# Altium schematic sheet LTE,GPS.SchDoc
size A; SheetNumber: 2; SheetTotal: 3
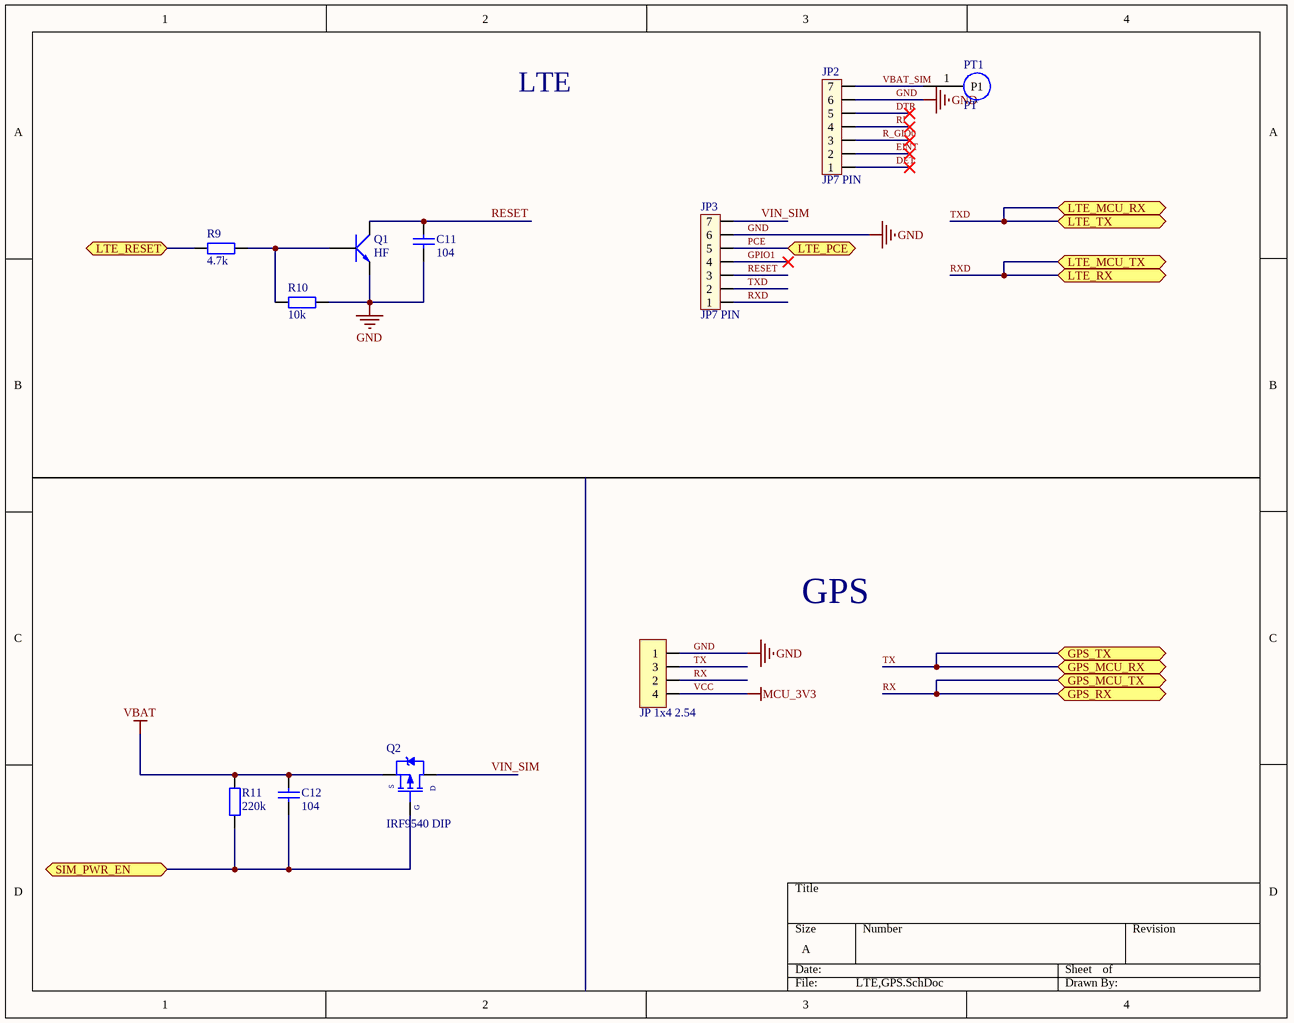
[diagram p0: LTE,GPS.SchDoc]

## Parts
C11  104  [tu 0805]
C12  104  [tu 0805]
JP2  JP7 PIN  [JP7]
JP3  JP7 PIN  [JP7]
JP4  JP 1x4 2.54  [JP 1x4 DC]
PT1  PT  [Test pont]  (no BOM)
Q1  HF  [SOT23]
Q2  IRF9540 DIP  [DPAK254P1511X469-3N]
R9  4.7k  [tro smd 0805]
R10  10k  [tro smd 0805]
R11  220k  [tro smd 0805]

## Ports
GPS_MCU_RX (bidir), GPS_MCU_TX (bidir), GPS_RX (bidir), GPS_TX (bidir), LTE_MCU_RX (bidir), LTE_MCU_TX (bidir), LTE_PCE (bidir), LTE_RESET (bidir), LTE_RX (bidir), LTE_TX (bidir), SIM_PWR_EN (bidir)

## Nets
GND: C11.1 JP2.6 JP3.6 JP4.1 Q1.2(E) R10.2
VBAT: C12.2 Q2.3(S) R11.2
VCC: JP4.4  [also labelled MCU_3V3]
DET: JP2.1
DTR: JP2.5
EINT: JP2.2
GPIO1: JP3.4
LTE_RESET: R9.1 ; port LTE_RESET
PCE: JP3.5 ; port LTE_PCE
R_GIO0: JP2.3
RESET: C11.2 JP3.3 Q1.3(C)
RI: JP2.4
RX: JP4.2 ; port GPS_MCU_TX, port GPS_RX
RXD: JP3.1 ; port LTE_MCU_TX, port LTE_RX
SIM_PWR_EN: C12.1 Q2.1(G) R11.1 ; port SIM_PWR_EN
TX: JP4.3 ; port GPS_MCU_RX, port GPS_TX
TXD: JP3.2 ; port LTE_MCU_RX, port LTE_TX
VBAT_SIM: JP2.7 PT1.1(P1)
VIN_SIM: JP3.7 Q2.2(D)
NetQ1_1: Q1.1(B) R9.2 R10.1

## Notes on the sheet
- LTE
- GPS

## Library data of the parts
C11 C12 = Tu 0805 104 50V 10%: Dán; Don_Vi: Con; So_Chan: 2; Ten_Linh_Kien: Tụ 0805 104-100nF 10% 50V; Ma_Hang: MH004551; Chung_Loai: Dán; Kieu_Chan: *
JP2 JP3 = JP7: Value: JP7
JP4 = JP 1x4 2.54 Duc Cong: Cắm; Ten_Linh_Kien: Jump Đơn Đực 2.54MM 1x40P Cong Đứng; Don_Vi: Con; Ma_Hang: MH000904; Ghi_Chu: *; Kieu_Chan: *; Chung_Loai: Cắm
PT1 = test pont
Q1 = C1815 HF SMD: NPN transistor; Value: C9014
Q2 = IRF9540 DIP: P-Channel Power MOSFET; Note: Pin 2 is electrically connected to pin 4.; Published: 8-Jun-2000; LatestRevisionDate: 17-Jul-2002; LatestRevisionNote: Re-released for DXP Platform.; DatasheetVersion: PD-9.421C; PackageVersion: Feb-1997; PackageReference: TO-220AB; Publisher: Altium Limited; PackageDescription: TO, Thru-Hole, Vertical, Heatsink Mounted; 3 In-Line Leads; Pitch 2.54 mm; ComponentLink1Description: Manufacturer Link; ComponentLink1URL: http://www.irf.com/; ComponentLink2Description: Datasheet; ComponentLink2URL: http://www.irf.com/product-info/datasheets/data/irf9540.pdf
R9 = Tro 0805 5% 4.7k: Dán; Don_Vi: Con; So_Chan: 2; Ten_Linh_Kien: Trở 0805 5% 4.7k; Ma_Hang: MH005307; Chung_Loai: Dán; Kieu_Chan: *
R10 = Tro 0805 5% 10k: Dán; Don_Vi: Con; So_Chan: 2; Ten_Linh_Kien: Trở 0805 5% 10k; Ma_Hang: MH005239; Chung_Loai: Dán; Kieu_Chan: *
R11 = Tro 0805 5% 220k: Dán; Don_Vi: Con; So_Chan: 2; Ten_Linh_Kien: Trở 0805 5% 220k; Ma_Hang: MH005258; Chung_Loai: Dán; Kieu_Chan: *